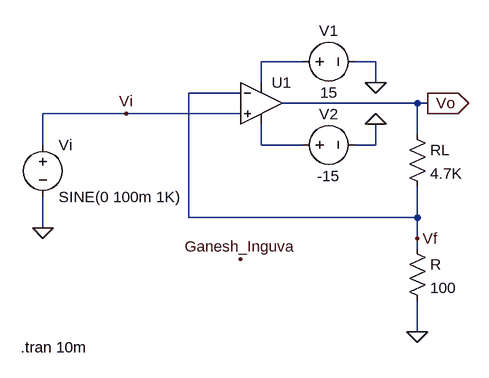
[diagram p0: schematic Run 3_B.asc]
Run 3_B.asc, the LTspice schematic file:
Version 4
SHEET 1 880 680
WIRE 288 -16 224 -16
WIRE 400 -16 368 -16
WIRE 224 16 224 -16
WIRE 400 16 400 -16
WIRE 192 32 112 32
WIRE 464 48 256 48
WIRE 480 48 464 48
WIRE 16 64 -112 64
WIRE 192 64 16 64
WIRE 464 96 464 48
WIRE -112 112 -112 64
WIRE 224 112 224 80
WIRE 288 112 224 112
WIRE 400 112 400 80
WIRE 400 112 368 112
WIRE 112 224 112 32
WIRE 464 224 464 176
WIRE 464 224 112 224
WIRE -112 240 -112 192
WIRE 464 256 464 224
WIRE 464 272 464 256
WIRE 464 400 464 352
FLAG 400 16 0
FLAG 400 80 0
FLAG 464 400 0
FLAG -112 240 0
FLAG 480 48 Vo
IOPIN 480 48 Out
FLAG 464 256 Vf
FLAG 16 64 Vi
FLAG 192 288 Ganesh_Inguva
SYMBOL OpAmps\\UniversalOpamp2 224 48 R0
SYMATTR InstName U1
SYMBOL voltage 272 -16 R270
WINDOW 0 32 56 VTop 2
WINDOW 3 -32 56 VBottom 2
WINDOW 123 0 0 Left 0
WINDOW 39 0 0 Left 0
SYMATTR InstName V1
SYMATTR Value 15
SYMBOL voltage 272 112 R270
WINDOW 0 32 56 VTop 2
WINDOW 3 -32 56 VBottom 2
WINDOW 123 0 0 Left 0
WINDOW 39 0 0 Left 0
SYMATTR InstName V2
SYMATTR Value -15
SYMBOL res 448 80 R0
SYMATTR InstName RL
SYMATTR Value 4.7K
SYMBOL res 448 256 R0
SYMATTR InstName R
SYMATTR Value 100
SYMBOL voltage -112 96 R0
WINDOW 123 0 0 Left 0
WINDOW 39 0 0 Left 0
SYMATTR InstName Vi
SYMATTR Value SINE(0 100m 1K)
TEXT -146 424 Left 2 !.tran 10m

The netlist it stands for:
* Run 3_B.asc
XU1 Vi Vf N001 N002 Vo level.2 Avol=1Meg GBW=10Meg Slew=10Meg ilimit=25m rail=0 Vos=0 phimargin=45 en=0 enk=0 in=0 ink=0 Rin=500Meg  ; pins IN+ IN- V+ V- OUT
V1 N001 0 15
V2 N002 0 -15
RL Vo Vf 4.7K
R Vf 0 100
Vi Vi 0 SINE(0 100m 1K)
.tran 10m
.lib UniversalOpamps2.sub
.backanno
.end